# Altium schematic sheet CAN UCM updated.SchDoc
size A4; SheetNumber: 2; SheetTotal: 5
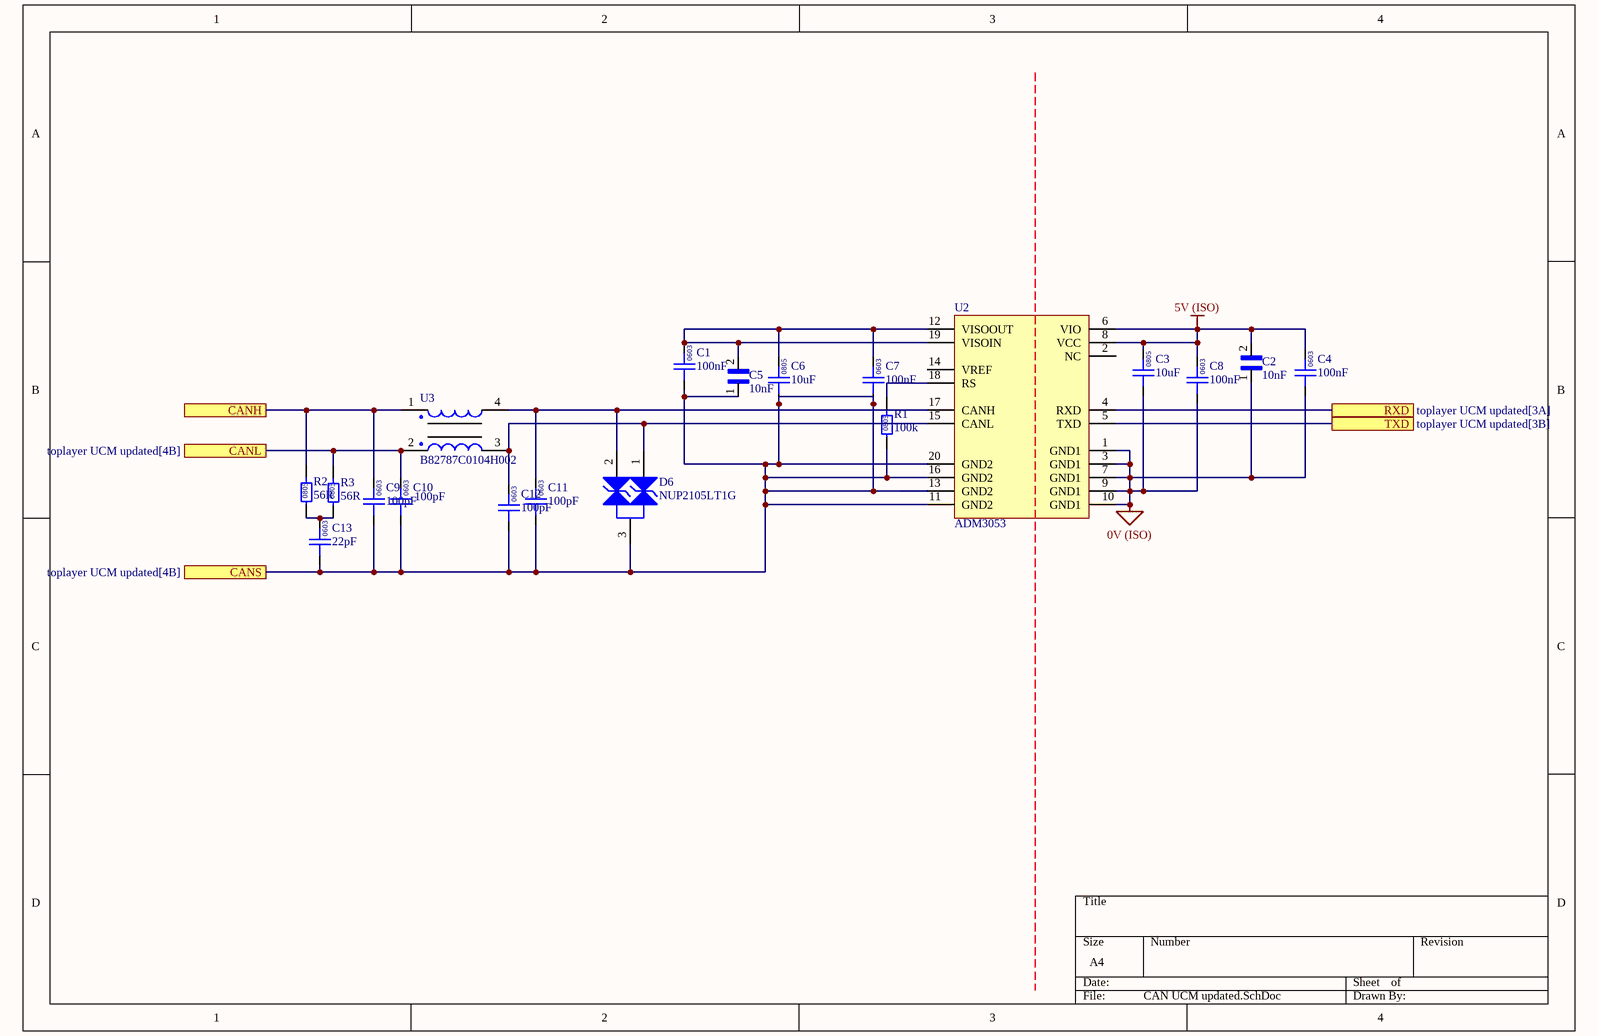
[diagram p0: CAN UCM updated.SchDoc]

## Parts
C1  100nF  [0603]
C2  10nF  [CAPC3216X95N]
C3  10uF  [0805]
C4  100nF  [0603]
C5  10nF  [CAPC3216X95N]
C6  10uF  [0805]
C7  100nF  [0603]
C8  100nF  [0603]
C9  100pF  [0603]
C10  100pF  [0603]
C11  100pF  [0603]
C12  100pF  [0603]
C13  22pF  [0603]
D6  NUP2105LT1G  [ONSC-SOT-23-3-318-08_V]
R1  100k  [0805]
R2  56R  [0805]
R3  56R  [0805]
U2  ADM3053  [AD SOIC-W 20]
U3  B82787C0104H002  [TDK 4-PC Pad]

## Ports
CANH (see toplayer UCM updated[4A]), CANL (see toplayer UCM updated[4B]), CANS (see toplayer UCM updated[4B]), RXD (see toplayer UCM updated[3A]), TXD (see toplayer UCM updated[3B])

## Nets
0V (ISO): C2.1 C3.1 C4.1 C8.1 U2.1(GND1) U2.3(GND1) U2.7(GND1) U2.9(GND1) U2.10(GND1)
5V (ISO): C2.2 C3.2 C4.2 C8.2 U2.6(VIO) U2.8(VCC)
CANH: C9.2 R2.2 U3.1 ; port CANH
CANL: C10.2 R3.2 U3.2 ; port CANL
CANS: C1.1 C5.1 C6.1 C7.1 C9.1 C10.1 C11.1 C12.1 C13.1 D6.3(K) R1.1 U2.11(GND2) U2.13(GND2) U2.16(GND2) U2.20(GND2) ; port CANS
RXD: U2.4(RXD) ; port RXD
TXD: U2.5(TXD) ; port TXD
NetC1_2: C1.2 C5.2 C6.2 C7.2 U2.12(VISOOUT) U2.19(VISOIN)
NetC11_2: C11.2 D6.2(K) U2.17(CANH) U3.4
NetC12_2: C12.2 D6.1(K) U2.15(CANL) U3.3
NetC13_2: C13.2 R2.1 R3.1
NetR1_2: R1.2 U2.18(RS)

Not connected (* = marked no-connect by the designer): U2 2(NC) 14(VREF)

## Notes on the sheet
- (in symbol GCM188L81H104KA57D) 0603
- (in symbol GRM21BR6YA106KE43L) 0805
- (in symbol GRM0335C1H220JA01D) 0603
- (in symbol GRM1885C1H101JA01D) 0603
- (in symbol RC0805FR0756RL) 0805
- (in symbol RC0805FR07100KL) 0805

## Library data of the parts
C1 C4 C7 C8 = GCM188L81H104KA57D: Manufacturer: muRata; Rated Voltage: 50V; Tolerance: ±10%; Material: MLCC; Temperature Rating: X8L; Part Number: GCM188L81H104KA57D; Value: 100nF; Digikey Part Number: 490-6049-1-ND
C2 C5 = GCM3195C2A103JA16D: 1206 0.01 uF 100 V Â±5% Tolerance C0G SMT Multilayer Ceramic Capacitor; MF: Murata Electronics; Check_prices: https://www.snapeda.com/parts/GCM3195C2A103JA16D/Murata%20Electronics%20North%20America/view-part/1773285/?ref=eda; Package: 3216 Murata; MP: GCM3195C2A103JA16D; Value: *; Availability: In Stock; SnapEDA_Link: https://www.snapeda.com/parts/GCM3195C2A103JA16D/Murata%20Electronics%20North%20America/view-part/1773285/?ref=snap; Price: None
C3 C6 = GRM21BR6YA106KE43L: Manufacturer: muRata; Rated Voltage: 50V; Tolerance: 10%; Material: MLCC; Temperature Rating: X5R; Part Number: GRM21BR6YA106KE43L; Value: 10uF; Digikey Part Number: 490-10514-6-ND
C9-C12 = GRM1885C1H101JA01D: Manufacturer: Murata Electronics; Rated Voltage: 50V; Tolerance: ±5%; Material: MLCC; Temperature Rating: C0G, NP0; Part Number: GRM1885C1H101JA01D; Value: 100pF; Digikey Part Number: 490-1427-1-ND
C13 = GRM0335C1H220JA01D: Manufacturer: Murata Electronics; Rated Voltage: 50V; Tolerance: ±5%; Material: MLCC; Temperature Rating: C0G, NP0; Part Number: GRM0335C1H220JA01D; Value: 22pF; Digikey Part Number: 490-6123-1-ND
D6 = CMP-1063-00164-1: Dual Line CAN Bus Protector, 3-Pin SOT-23, Pb-Free, Tape and Reel; Manufacturer: On Semiconductor; IR Max (uA): 0.1; Number of Lines: 2; Direction: Bidirectional; C Max (pF): 30; PPK Max (W): 350; V(BR) Min (V): 26.2; ComponentLink3URL: http://www.onsemi.cn/pub_link/Collateral/318-08.PDF; Mounting Technology: Surface Mount; ComponentLink2Description: Datasheet; PartNumber: NUP2105LT1G; ComponentLink1URL: http://www.onsemi.com/; PackageVersion: Rev. AP, 11/2009; DatasheetVersion: Rev. 5; RoHS: Pb-Free; PackageReference: SOT-23-3-318-08; ComponentLink2URL: http://www.onsemi.cn/pub_link/Collateral/NUP2105L-D.PDF; ComponentLink1Description: Manufacturer URL; PackageDescription: 3-Pin Small Outline Transistor, Body 2.92 x 1.3 mm, Pitch 0.95 mm; Packing: Tape and Reel; ComponentLink3Description: Package Specification
R1 = RC0805FR07100KL: Manufacturer: YAGEO; Tolerance: 0.01; Rated Power: 0.125W; Part Number: RC0805FR07100KL; Value: 100k; Material: FR-07; Digikey Part Number: 311-100KCRCT-ND
R2 R3 = RC0805FR0756RL: Manufacturer: YAGEO; Tolerance: 0.01; Rated Power: 0.125W; Part Number: RC0805FR0756RL; Value: 56R; Material: FR-07; Digikey Part Number: 311-56.0CRCT-ND
U2 = ADM3053: Isolated CAN Transceiver; Manufacturer: Analogue Devices; Complex IC: 1; Part Number: ADM3053; Digikey Part Number: ADM3053BRWZ-ND; Digikey Link: https://www.digikey.com/product-detail/en/analog-devices-inc/ADM3053BRWZ/ADM3053BRWZ-ND/2709332
U3 = B82787C0104H002: Manufacturer: EPCOS (TDK); Value: 100µH @ 100kHz; Impedance: 5.8 kOhms @ 10MHz; Rated Current: 150mA; Part Number: B82787C0104H002; Material: Wirewound; Digikey Part Number: 495-4598-1-ND